# Altium schematic sheet Collector Coupled Astable Multivibrator.schdoc: Collector Coupled Astable Multivibrator
size A4; Organization: Altium Limited; Address1: L3, 12a Rodborough Rd; Address2: Frenchs Forest; Address3: NSW; Address4: Australia 2086; DocumentNumber: 1; SheetNumber: 1; SheetTotal: 1
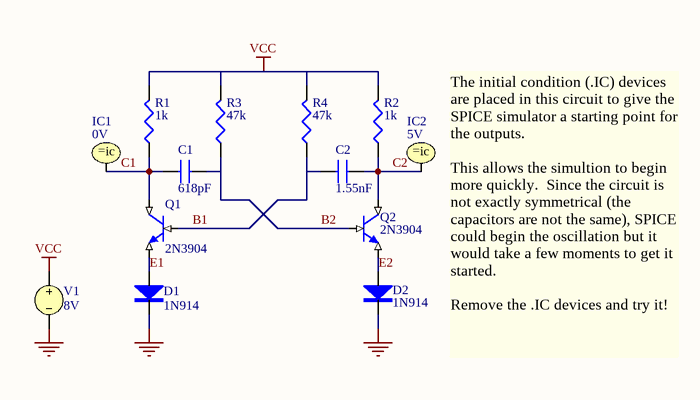
[diagram p0: Collector Coupled Astable Multivibrator.schdoc]

## Parts
C1  618pF
C2  1.55nF
D1  1N914
D2  1N914
IC1  0V
IC2  5V
Q1  2N3904
Q2  2N3904
R1  1k
R2  1k
R3  47k
R4  47k
V1  value 8V  (hidden comment: VSRC)

## Nets
GND: D1.2(K) D2.2(K) V1.2
VCC: R1.1(TOP) R2.1(TOP) R3.1(TOP) R4.1(TOP) V1.1
B1: C2.1 Q1.2(B) R4.2(BOT)
B2: C1.2 Q2.2(B) R3.2(BOT)
C1: C1.1 IC1.1 Q1.1(C) R1.2(BOT)
C2: C2.2 IC2.1 Q2.1(C) R2.2(BOT)
E1: D1.1(A) Q1.3(E)
E2: D2.1(A) Q2.3(E)

## Notes on the sheet
- (near IC2) The initial condition (.IC) devices are placed in this circuit to give the SPICE simulator a starting point for the outputs.
  This allows the simultion to begin more quickly.  Since the circuit is not exactly symmetrical (the capacitors are not the same), SPICE could begin the oscillation but it would take a few moments to get it started.
  Remove the .IC devices and try it!
- Title
- Size:
- Date:
- A4
- Number:
- Time:
- Revision:
- Sheet
- of
- File:

## Library data of the parts
C1 C2 = CAP: Capacitor
  C1: Value: 618pF
  C2: Value: 1.55nF
D1 D2 = 1N914: Diode
IC1 IC2 = .IC: Initial Condition
  IC1: Initial Voltage: 0V
  IC2: Initial Voltage: 5V
Q1 Q2 = 2N3904: NPN BJT
R1-R4 = RES: Resistor
  R1 R2: Value: 1k
  R3 R4: Value: 47k
V1 = VSRC: Voltage Source